# Altium project BodyTubeRev.PrjPcb
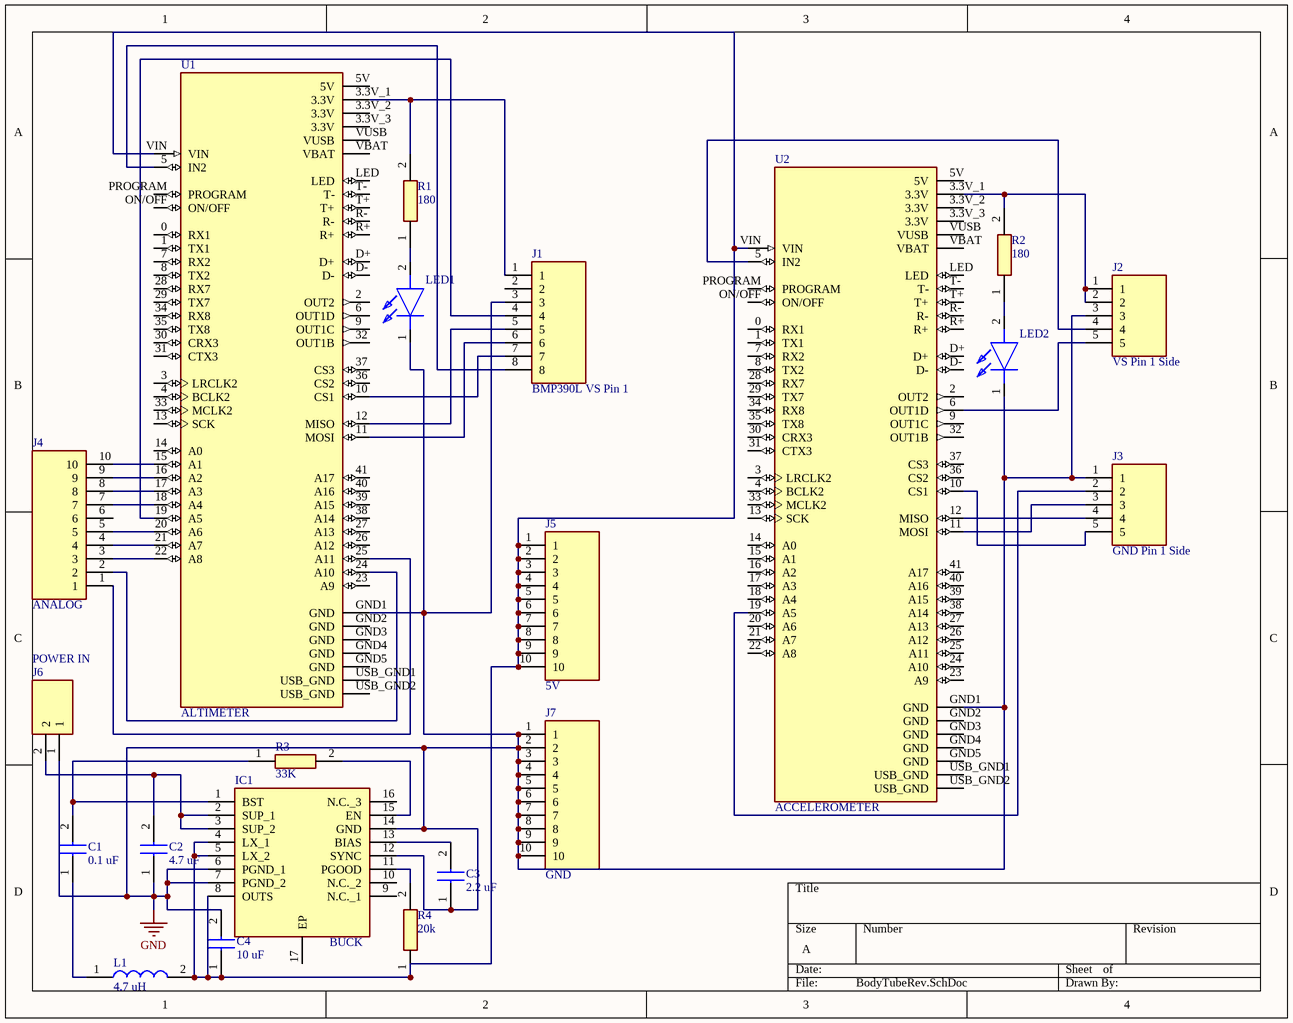
[diagram p0: BodyTubeRev.SchDoc]
1 sheet, 21 parts. Net scope: global (net labels, ports and power ports of the same name join across sheets).
Board file: BodyTubeRev.PcbDoc

## Sheet BodyTubeRev.SchDoc
size A; SheetNumber: 1; SheetTotal: 1

### Parts
C1  0.1 uF  [CAPC2012X88N]
C2  4.7 uF  [CAPC2012X140N]
C3  2.2 uF  [CAPC2012X140N]
C4  10 uF  [CAPC2012X140N]
IC1  BUCK  [SOP65P638X110-17N]
J1  BMP390L VS Pin 1  [HDRV8W64P0X254_1X8_2032X254X813P]
J2  VS Pin 1 Side  [HDRV5W64P0X254_1X5_1270X254X813P]
J3  GND Pin 1 Side  [HDRV5W64P0X254_1X5_1270X254X813P]
J4  ANALOG  [RHDR10W80P0X254_1X10_2590X254X850P]
J5  5V  [RHDR10W80P0X254_1X10_2590X254X850P]
J6  POWER IN  [0436500201]
J7  GND  [RHDR10W80P0X254_1X10_2590X254X850P]
L1  4.7 uH  [LQM2HPN1R0MG0L]
LED1  (no value)  [LEDC2012X80N]
LED2  (no value)  [LEDC2012X80N]
R1  180  [ERJ6EN_(0805)]
R2  180  [ERJ6EN_(0805)]
R3  33K  [ERJ6ENF1000V]
R4  20k  [RESC2012X70N]
U1  ALTIMETER  [MODULE_DEV-16771]
U2  ACCELEROMETER  [MODULE_DEV-16771]

### Nets
GND: C2.1 C3.1 C4.2 IC1.6(PGND_1) IC1.7(PGND_2) IC1.12(SYNC) IC1.14(GND) J1.3 J2.3 J3.1 J6.1 J7.1 J7.2 J7.3 J7.4 J7.5 J7.6 J7.7 J7.8 J7.9 J7.10 LED1.1(K) LED2.1(K) U1.GND1(GND) U2.GND1(GND)
NetC1_1: C1.1 L1.1
NetC1_2: C1.2 IC1.1(BST) R3.1
NetC2_2: C2.2 IC1.2(SUP_1) IC1.3(SUP_2) J6.2
NetC3_2: C3.2 IC1.13(BIAS)
NetC4_1: C4.1 IC1.4(LX_1) IC1.5(LX_2) IC1.8(OUTS) J5.1 J5.2 J5.3 J5.4 J5.5 J5.6 J5.7 J5.8 J5.9 J5.10 L1.2 R4.1 U1.VIN U2.VIN
NetIC1_11: IC1.11(PGOOD) R4.2
NetIC1_15: IC1.15(EN) R3.2
NetJ1_1: J1.1 R1.2 U1.3.3V_1(3.3V)
NetJ1_4: J1.4 U1.19(A5)
NetJ1_5: J1.5 U1.12(MISO)
NetJ1_6: J1.6 U1.11(MOSI)
NetJ1_7: J1.7 U1.10(CS1)
NetJ1_8: J1.8 U1.5(IN2)
NetJ2_1: J2.1 J2.2 R2.2 U2.3.3V_1(3.3V)
NetJ2_4: J2.4 U2.5(IN2)
NetJ2_5: J2.5 U2.6(OUT1D)
NetJ3_2: J3.2 U2.19(A5)
NetJ3_3: J3.3 U2.11(MOSI)
NetJ3_4: J3.4 U2.12(MISO)
NetJ3_5: J3.5 U2.10(CS1)
NetJ4_1: J4.1 U1.25(A11)
NetJ4_2: J4.2 U1.24(A10)
NetJ4_3: J4.3 U1.22(A8)
NetJ4_4: J4.4 U1.21(A7)
NetJ4_5: J4.5 U1.20(A6)
NetJ4_7: J4.7 U1.18(A4)
NetJ4_8: J4.8 U1.17(A3)
NetJ4_9: J4.9 U1.16(A2)
NetJ4_10: J4.10 U1.15(A1)
NetLED1_2: LED1.2(A) R1.1
NetLED2_2: LED2.2(A) R2.1

Not connected (* = marked no-connect by the designer): IC1 9(N.C._1) 10(N.C._2) 16(N.C._3) 17(EP); J1 2; J4 6; U1 0(RX1) 1(TX1) 2(OUT2) 3(LRCLK2) 3.3V_2(3.3V) 3.3V_3(3.3V) 4(BCLK2) 5V 6(OUT1D) 7(RX2) 8(TX2) 9(OUT1C) 13(SCK) 14(A0) 23(A9) 26(A12) 27(A13) 28(RX7) 29(TX7) 30(CRX3) 31(CTX3) 32(OUT1B) 33(MCLK2) 34(RX8) 35(TX8) 36(CS2) 37(CS3) 38(A14) 39(A15) 40(A16) 41(A17) D+ D- GND2(GND) GND3(GND) GND4(GND) GND5(GND) LED ON/OFF PROGRAM R+ R- T+ T- USB_GND1(USB_GND) USB_GND2(USB_GND) VBAT VUSB; U2 0(RX1) 1(TX1) 2(OUT2) 3(LRCLK2) 3.3V_2(3.3V) 3.3V_3(3.3V) 4(BCLK2) 5V 7(RX2) 8(TX2) 9(OUT1C) 13(SCK) 14(A0) 15(A1) 16(A2) 17(A3) 18(A4) 20(A6) 21(A7) 22(A8) 23(A9) 24(A10) 25(A11) 26(A12) 27(A13) 28(RX7) 29(TX7) 30(CRX3) 31(CTX3) 32(OUT1B) 33(MCLK2) 34(RX8) 35(TX8) 36(CS2) 37(CS3) 38(A14) 39(A15) 40(A16) 41(A17) D+ D- GND2(GND) GND3(GND) GND4(GND) GND5(GND) LED ON/OFF PROGRAM R+ R- T+ T- USB_GND1(USB_GND) USB_GND2(USB_GND) VBAT VUSB

### Library data of the parts
C1 = C0805C222K5RAC7025: Capacitor; Manufacturer_Name: KEMET; Datasheet Link: https://componentsearchengine.com/Datasheets/1/C0805C222K5RAC7025.pdf; Height: 0.88mm; Manufacturer_Part_Number: C0805C222K5RAC7025; Mouser Part Number: 80-C0805C222K5RACTM; Mouser Price/Stock: https://www.mouser.com/Search/Refine.aspx?Keyword=80-C0805C222K5RACTM
C2 = GRM21BR61H475KE51L: Capacitor; Manufacturer_Name: Murata Electronics; Datasheet Link: https://www.murata.com/en-global/products/productdetail?partno=GRM21BR61H475KE51%23; Height: 1.4mm; Manufacturer_Part_Number: GRM21BR61H475KE51L; Mouser Part Number: 81-GRM21BR61H475KE1L; Mouser Price/Stock: https://www.mouser.co.uk/ProductDetail/Murata-Electronics/GRM21BR61H475KE51L?qs=eeBpzGFlv%252B%252BOtLzDC1PY6Q%3D%3D; Arrow Part Number: GRM21BR61H475KE51L; Arrow Price/Stock: https://www.arrow.com/en/products/grm21br61h475ke51l/murata-manufacturing
C3 C4 = C0805C106K8PAC7800: Capacitor; Manufacturer_Name: KEMET; Datasheet Link: https://www.kemet.com/specsheet/C0805C106K8PACTU; Height: 1.4mm; Manufacturer_Part_Number: C0805C106K8PAC7800; Mouser Part Number: N/A; Mouser Price/Stock: https://www.mouser.co.uk/ProductDetail/KEMET/C0805C106K8PAC7800?qs=IIhARexJuVizGHbK1ryyMw%3D%3D; Arrow Part Number: C0805C106K8PAC7800; Arrow Price/Stock: https://www.arrow.com/en/products/c0805c106k8pac7800/kemet-corporation
IC1 = MAX16903RAUE50_V+: Integrated Circuit; Manufacturer_Name: Maxim Integrated; Manufacturer_Part_Number: MAX16903RAUE50/V+; Datasheet Link: https://datasheets.maximintegrated.com/en/ds/MAX16903.pdf; Height: 1.1mm; Mouser Part Number: 700-16903RAUE50/V+; Mouser Price/Stock: https://www.mouser.co.uk/ProductDetail/Maxim-Integrated/MAX16903RAUE50-V%2b?qs=Mc2rGIXtnyUsUinGDh5nEw%3D%3D
J1 = DW-08-07-T-S-200: Connector; Manufacturer_Name: SAMTEC; Datasheet Link: https://suddendocs.samtec.com/catalog_english/dw.pdf; Height: 8.13mm; Manufacturer_Part_Number: DW-08-07-T-S-200; Mouser Part Number: 200-DW0807TS200; Mouser Price/Stock: https://www.mouser.co.uk/ProductDetail/Samtec/DW-08-07-T-S-200?qs=wPucwuAL3e1XRCWx48%252BLdg%3D%3D; Arrow Part Number: DW-08-07-T-S-200; Arrow Price/Stock: https://www.arrow.com/en/products/dw-08-07-t-s-200/samtec
J2 J3 = DW-05-07-T-S-200: Connector; Manufacturer_Name: SAMTEC; Datasheet Link: https://www.mouser.com/datasheet/2/527/dw-1369989.pdf; Height: 8.13mm; Manufacturer_Part_Number: DW-05-07-T-S-200; Mouser Part Number: 200-DW0507TS200; Mouser Price/Stock: https://www.mouser.co.uk/ProductDetail/Samtec/DW-05-07-T-S-200?qs=0lQeLiL1qyZSRFH01KKlBQ%3D%3D; Arrow Part Number: DW-05-07-T-S-200; Arrow Price/Stock: https://www.arrow.com/en/products/dw-05-07-t-s-200/samtec
J4 J5 J7 = PPTC101LFBN-RC: Connector; Manufacturer_Name: Sullins; Datasheet Link: http://www.sullinscorp.com/drawings/78_P(N)PxCxxxLFBN-RC,_10492-H.pdf; Height: 8.5mm; Manufacturer_Part_Number: PPTC101LFBN-RC
J6 = 0436500201: Connector; Manufacturer_Name: Molex; Datasheet Link: https://www.molex.com/pdm_docs/ps/PS-43650.pdf; Height: 5.82mm; Manufacturer_Part_Number: 0436500201; Mouser Part Number: N/A; Mouser Price/Stock: https://www.mouser.co.uk/ProductDetail/Molex/0436500201?qs=PBcRNPEHKsr2cwDQOTxBPQ%3D%3D; Arrow Part Number: 0436500201; Arrow Price/Stock: https://www.arrow.com/en/products/0436500201/molex?region=europe
L1 = LQH2HPN4R7MGRL: Inductor; Manufacturer_Name: Murata Electronics; Datasheet Link: https://psearch.en.murata.com/inductor/product/LQH2HPN4R7MGR%23.html; Height: 1mm; Manufacturer_Part_Number: LQH2HPN4R7MGRL; Mouser Part Number: 81-LQH2HPN4R7MGRL; Mouser Price/Stock: https://www.mouser.co.uk/ProductDetail/Murata-Electronics/LQH2HPN4R7MGRL?qs=F2r4PX9PQ5%2FHtLwVyG%252BobA%3D%3D
LED1 LED2 = HSMG-C170: LED; Manufacturer_Name: Avago Technologies; Datasheet Link: https://datasheet.datasheetarchive.com/originals/distributors/SFDatasheet-4/sf-00083853.pdf; Height: 0.8mm; Manufacturer_Part_Number: HSMG-C170; Mouser Part Number: 630-HSMG-C170; Mouser Price/Stock: https://www.mouser.co.uk/ProductDetail/Broadcom-Avago/HSMG-C170?qs=YDL0qNrpDT4lm8ArMPkMEA%3D%3D
R1 R2 = ERJ-6ENF1800V: Resistor; Manufacturer_Name: Panasonic; Datasheet Link: http://industrial.panasonic.com/cdbs/www-data/pdf/RDA0000/AOA0000C304.pdf; Height: 0.55mm; Manufacturer_Part_Number: ERJ-6ENF1800V; Mouser Part Number: 667-ERJ-6ENF1800V; Mouser Price/Stock: https://www.mouser.com/Search/Refine.aspx?Keyword=667-ERJ-6ENF1800V
R3 = ERJ-6ENF33R0V: Resistor; Manufacturer_Name: Panasonic; Datasheet Link: https://industrial.panasonic.com/cdbs/www-data/pdf/RDA0000/AOA0000C84.pdf; Height: 0.7mm; Manufacturer_Part_Number: ERJ-6ENF33R0V; Mouser Part Number: 667-ERJ-6ENF33R0V; Mouser Price/Stock: https://www.mouser.com/Search/Refine.aspx?Keyword=667-ERJ-6ENF33R0V; Arrow Part Number: ERJ-6ENF33R0V; Arrow Price/Stock: https://www.arrow.com/en/products/erj-6enf33r0v/panasonic
R4 = ERJ-6GEYJ203V: Resistor; Manufacturer_Name: Panasonic; Datasheet Link: https://datasheet.datasheetarchive.com/originals/distributors/DKDS40/DSANUWW0010960.pdf; Height: 0.7mm; Manufacturer_Part_Number: ERJ-6GEYJ203V; Mouser Part Number: 667-ERJ-6GEYJ203V; Mouser Price/Stock: https://www.mouser.co.uk/ProductDetail/Panasonic/ERJ-6GEYJ203V?qs=tQNqqtTOejJRgZ3KHnkKUg%3D%3D; Arrow Part Number: ERJ-6GEYJ203V; Arrow Price/Stock: https://www.arrow.com/en/products/erj-6geyj203v/panasonic?region=nac
U1 U2 = DEV-16771: RT1062 Teensy 4.1 i.MX ARM Cortex-M7 MPU Embedded Evaluation Board; Value: *; Availability: Unavailable; Price: None; MP: DEV-16771; Package: None